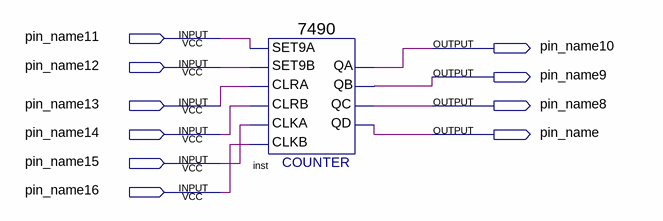
[diagram p0: schematic sheet]
// Quartus schematic test.bdf as structural Verilog: 1 symbols, 10 pins
module test (
  input  pin_name11,
  input  pin_name12,
  input  pin_name13,
  input  pin_name14,
  input  pin_name15,
  input  pin_name16,
  output pin_name10,
  output pin_name9,
  output pin_name8,
  output pin_name
);

  \7490  inst (
    .SET9A(pin_name11), .CLRA(pin_name13), .SET9B(pin_name12), .CLKB(pin_name16), .CLKA(pin_name15),
    .CLRB(pin_name14), .QD(pin_name), .QA(pin_name10), .QB(pin_name9), .QC(pin_name8));
endmodule
